# Altium schematic sheet 03.PowerDiagram.SchDoc
size A3; SheetNumber: 3; SheetTotal: 4
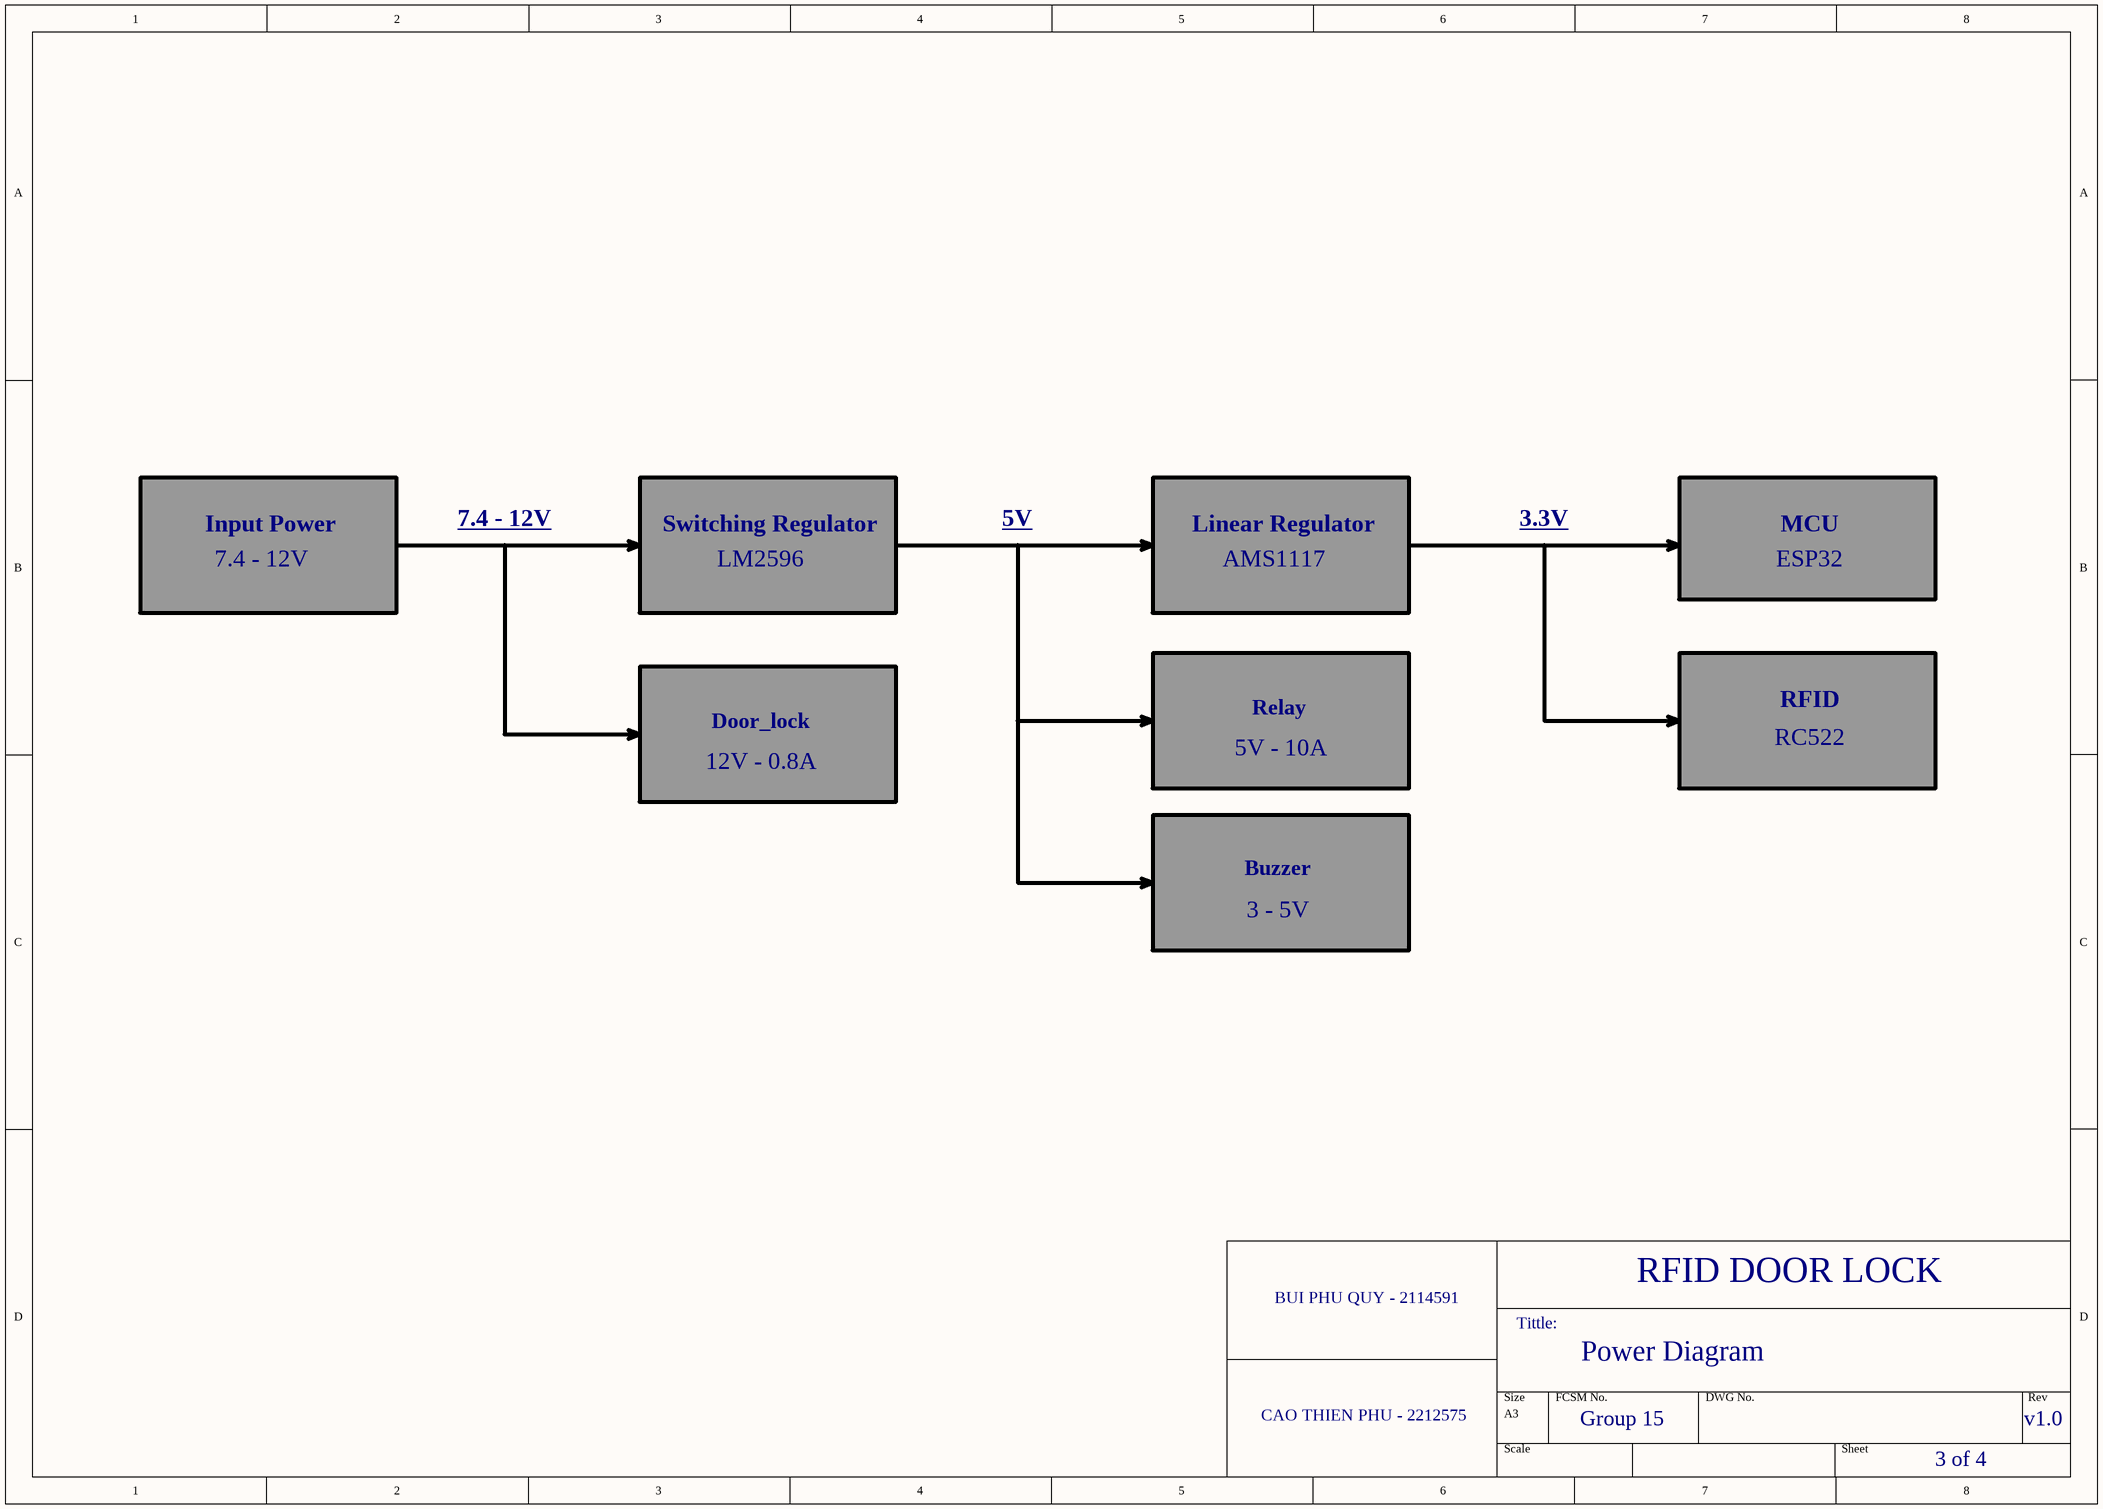
[diagram p0: 03.PowerDiagram.SchDoc]

## Notes on the sheet
- Input Power
- 7.4 - 12V
- Switching Regulator
- 5V
- Linear Regulator
- 3.3V
- MCU
- LM2596
- AMS1117
- ESP32
- Door_lock
- Relay
- RFID
- 12V - 0.8A
- 5V - 10A
- RC522
- Buzzer
- 3 - 5V
- BUI PHU QUY - 2114591
- Tittle:
- RFID DOOR LOCK
- Power Diagram
- CAO THIEN PHU - 2212575
- Group 15
- v1.0
- 3 of 4